# EasyEDA Pro project ProProject_NAFA AstrAlim_2024-01-08.epro, schematic AstrAlim NAFA

## Sheets
1 Base: Create Date: 2023-12-12; Page Name: Base; Project Name: NAFA AstrAlim; Schematic Name: AstrAlim NAFA; Update Date: 2024-01-05; Company: Velizy Astro Club; Drawed: Paul V.; Page Size: A4; Part Number: AstrAlim-v1.0; Reviewed: Denis G.; Version: V1.0
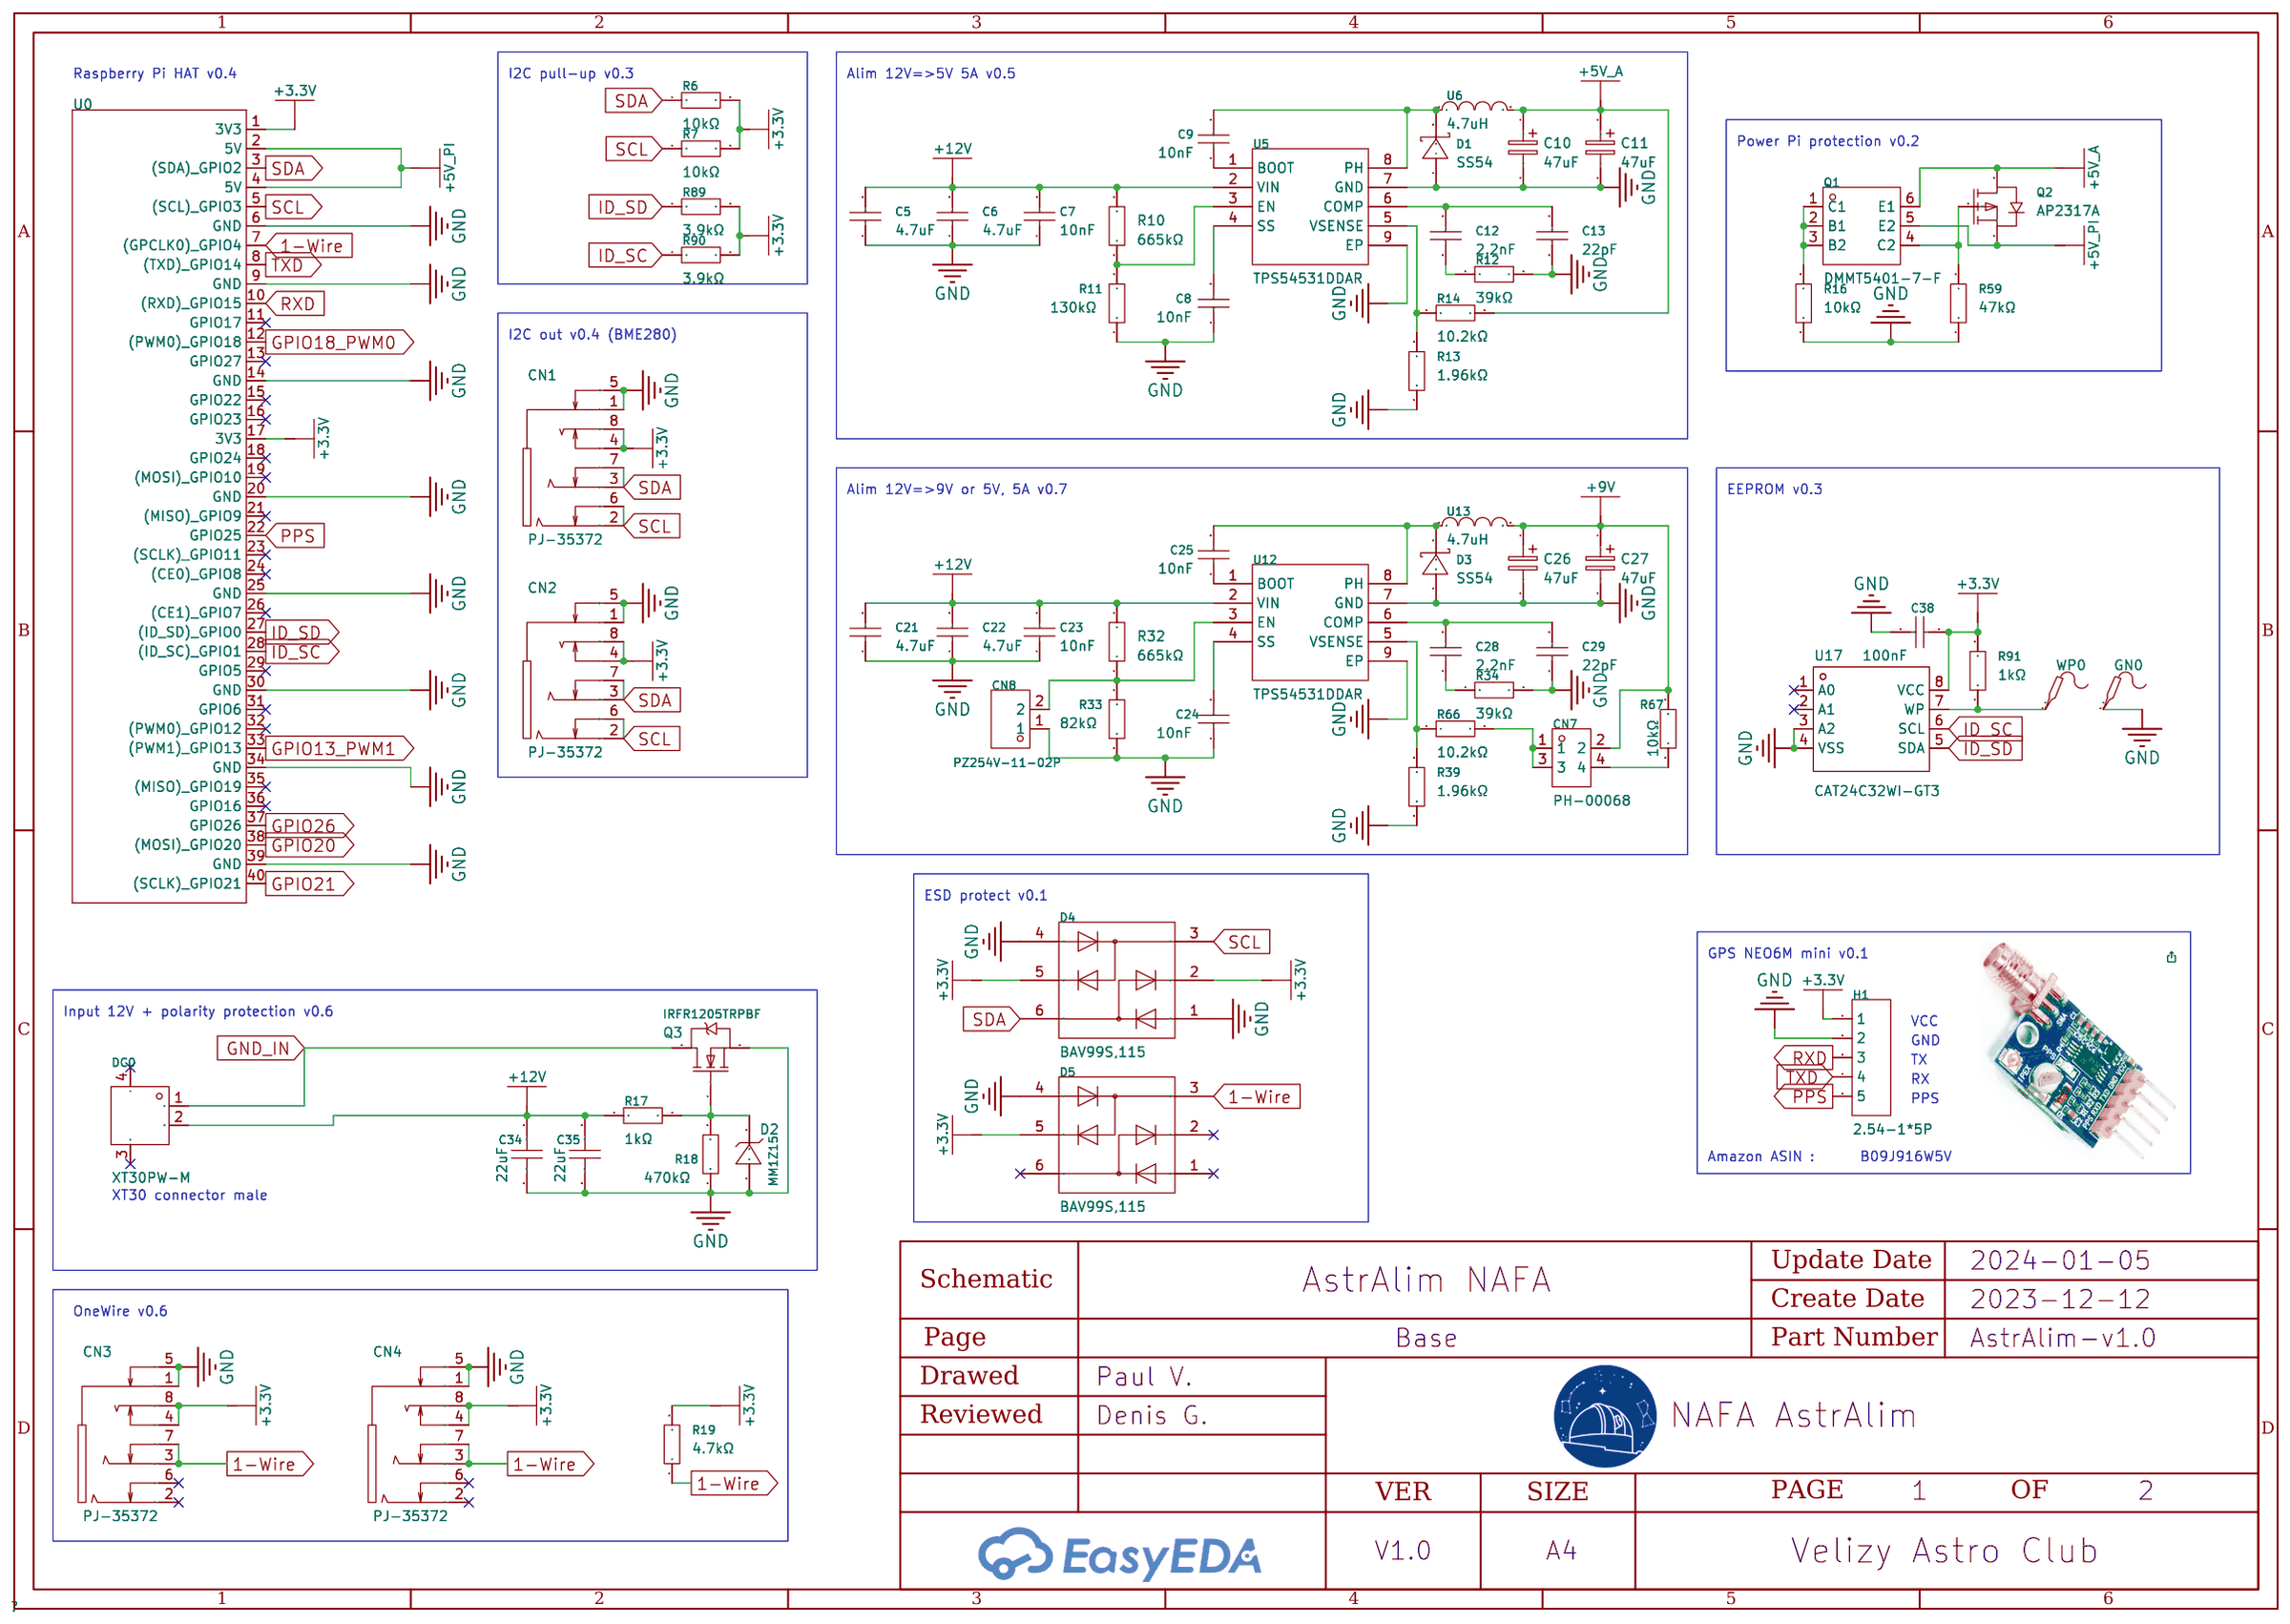
[diagram p0: Base]
2 Outputs: Create Date: 2023-12-28; Page Name: Outputs
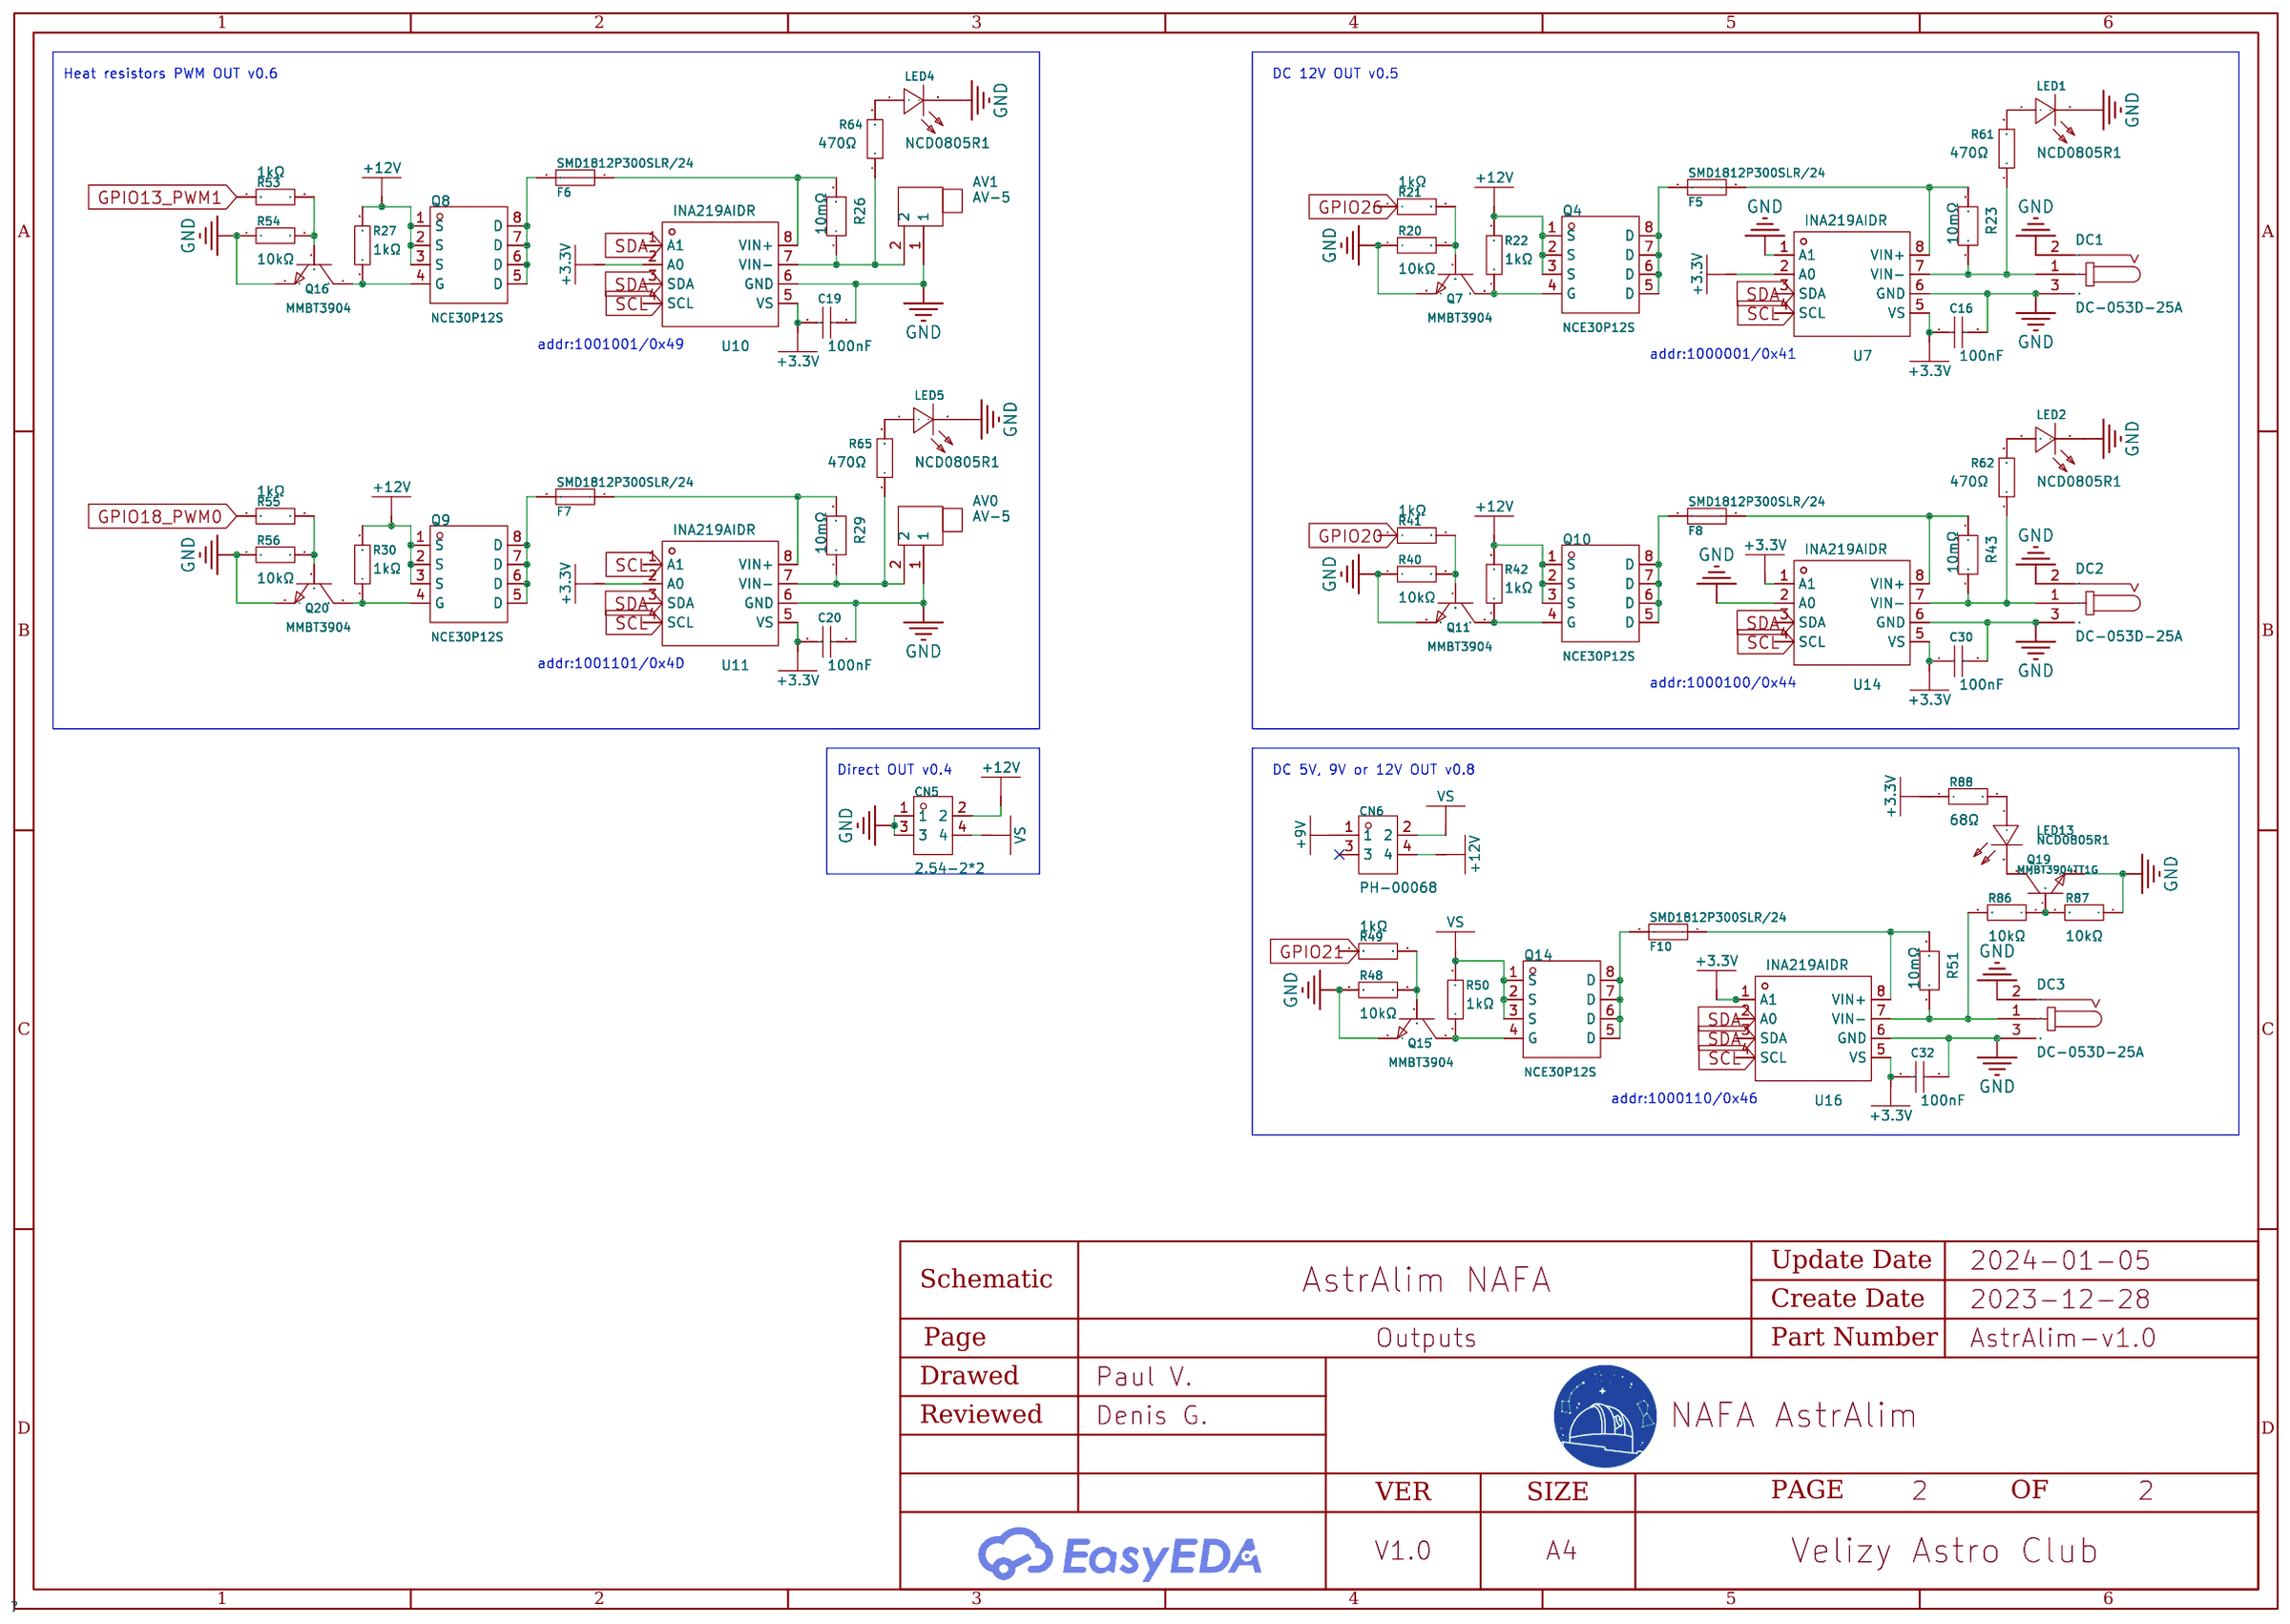
[diagram p1: Outputs]

## Parts
sheet Base
C5  4.7uF  [C0805]
C6  4.7uF  [C0805]
C7  10nF  [C0402]
C8  10nF  [C0402]
C9  10nF  [C0402]
C10  47uF  [CAP-SMD_L3.5-W2.8-R-RD]
C11  47uF  [CAP-SMD_L3.5-W2.8-R-RD]
C12  2.2nF  [C0603]
C13  22pF  [C0402]
C21  4.7uF  [C0805]
C22  4.7uF  [C0805]
C23  10nF  [C0402]
C24  10nF  [C0402]
C25  10nF  [C0402]
C26  47uF  [CAP-SMD_L3.5-W2.8-R-RD]
C27  47uF  [CAP-SMD_L3.5-W2.8-R-RD]
C28  2.2nF  [C0603]
C29  22pF  [C0402]
C34  22uF  [C0805]
C35  22uF  [C0805]
C38  100nF  [C0402]
CN1  PJ-35372  [AUDIO-TH_PJ-35372]
CN2  PJ-35372  [AUDIO-TH_PJ-35372]
CN3  PJ-35372  [AUDIO-TH_PJ-35372]
CN4  PJ-35372  [AUDIO-TH_PJ-35372]
CN7  PH-00068  [HDR-TH_4P-P2.54-V-M-R2-C2-S2.54]
CN8  PZ254V-11-02P  [HDR-TH_2P-P2.54-V-M]
D1  SS54  [SMA_L4.4-W2.8-LS5.4-R-RD]
D2  MM1Z15  [SOD-123_L2.7-W1.6-LS3.7-RD]
D3  SS54  [SMA_L4.4-W2.8-LS5.4-R-RD]
D4  BAV99S,115  [SOT-363_L2.0-W1.3-P0.65-LS2.1-TL]
D5  BAV99S,115  [SOT-363_L2.0-W1.3-P0.65-LS2.1-TL]
DC0  XT30PW-M  [CONN-TH_XT30PW-F-1]
GN0  -  [Test-Point-0.5mm]
H1  2.54-1*5P  [HDR-TH_5P-P2.54-V-F]
Q1  DMMT5401-7-F  [SOT-23-6_L2.9-W1.6-P0.95-LS2.8-BR]
Q2  AP2317A  [SOT-23-3_L2.9-W1.6-P1.90-LS2.8-BR]
Q3  IRFR1205TRPBF  [TO-252-3_L6.5-W5.8-P4.58-BL]
R6  10kΩ  [R0402]
R7  10kΩ  [R0402]
R10  665kΩ  [R0603]
R11  130kΩ  [R0603]
R12  39kΩ  [R0603]
R13  1.96kΩ  [R0402]
R14  10.2kΩ  [R0402]
R16  10kΩ  [R0402]
R17  1kΩ  [R0402]
R18  470kΩ  [R0603]
R19  4.7kΩ  [R0402]
R32  665kΩ  [R0603]
R33  82kΩ  [R0603]
R34  39kΩ  [R0603]
R39  1.96kΩ  [R0402]
R59  47kΩ  [R0402]
R66  10.2kΩ  [R0402]
R67  10kΩ  [R0402]
R89  3.9kΩ  [R0603]
R90  3.9kΩ  [R0603]
R91  1kΩ  [R0402]
U0  RASPI HAT FULL  [RASBERRYPI-3-HAT-EXT]  (no BOM)
U5  TPS54531DDAR  [SOIC-8_L5.0-W4.0-P1.27-LS6.0-BL-EP2.0]
U6  4.7uH  [IND-SMD_L7.2-W6.6_GPSR07X0]
U12  TPS54531DDAR  [SOIC-8_L5.0-W4.0-P1.27-LS6.0-BL-EP2.0]
U13  4.7uH  [IND-SMD_L7.2-W6.6_GPSR07X0]
U17  CAT24C32WI-GT3  [SOIC-8_L5.0-W4.0-P1.27-LS6.0-BL]
WP0  -  [Test-Point-0.5mm]
sheet Outputs
AV0  AV-5  [CONN-TH_AV-5]
AV1  AV-5  [CONN-TH_AV-5]
C16  100nF  [C0402]
C19  100nF  [C0402]
C20  100nF  [C0402]
C30  100nF  [C0402]
C32  100nF  [C0402]
CN5  2.54-2*2  [HDR-TH_4P-P2.54-V-F-R2-C2-S2.54]
CN6  PH-00068  [HDR-TH_4P-P2.54-V-M-R2-C2-S2.54]
DC1  DC-053D-25A  [DC-IN-TH_DC-053D-25A-1]
DC2  DC-053D-25A  [DC-IN-TH_DC-053D-25A-1]
DC3  DC-053D-25A  [DC-IN-TH_DC-053D-25A-1]
F5  SMD1812P300SLR/24  [F1812]
F6  SMD1812P300SLR/24  [F1812]
F7  SMD1812P300SLR/24  [F1812]
F8  SMD1812P300SLR/24  [F1812]
F10  SMD1812P300SLR/24  [F1812]
LED1  NCD0805R1  [LED0805-R-RD]
LED2  NCD0805R1  [LED0805-R-RD]
LED4  NCD0805R1  [LED0805-R-RD]
LED5  NCD0805R1  [LED0805-R-RD]
LED13  NCD0805R1  [LED0805-R-RD]
Q4  NCE30P12S  [SOIC-8_L4.9-W3.9-P1.27-LS6.0-BL]
Q7  MMBT3904  [SOT-23-3_L2.9-W1.3-P1.90-LS2.4-BR]
Q8  NCE30P12S  [SOIC-8_L4.9-W3.9-P1.27-LS6.0-BL]
Q9  NCE30P12S  [SOIC-8_L4.9-W3.9-P1.27-LS6.0-BL]
Q10  NCE30P12S  [SOIC-8_L4.9-W3.9-P1.27-LS6.0-BL]
Q11  MMBT3904  [SOT-23-3_L2.9-W1.3-P1.90-LS2.4-BR]
Q14  NCE30P12S  [SOIC-8_L4.9-W3.9-P1.27-LS6.0-BL]
Q15  MMBT3904  [SOT-23-3_L2.9-W1.3-P1.90-LS2.4-BR]
Q16  MMBT3904  [SOT-23-3_L2.9-W1.3-P1.90-LS2.4-BR]
Q19  MMBT3904TT1G  [SC-75-3_L1.6-W0.8-P1.00-LS1.6-BR]
Q20  MMBT3904  [SOT-23-3_L2.9-W1.3-P1.90-LS2.4-BR]
R20  10kΩ  [R0402]
R21  1kΩ  [R0402]
R22  1kΩ  [R0402]
R23  10mΩ  [R1206]
R26  10mΩ  [R1206]
R27  1kΩ  [R0402]
R29  10mΩ  [R1206]
R30  1kΩ  [R0402]
R40  10kΩ  [R0402]
R41  1kΩ  [R0402]
R42  1kΩ  [R0402]
R43  10mΩ  [R1206]
R48  10kΩ  [R0402]
R49  1kΩ  [R0402]
R50  1kΩ  [R0402]
R51  10mΩ  [R1206]
R53  1kΩ  [R0402]
R54  10kΩ  [R0402]
R55  1kΩ  [R0402]
R56  10kΩ  [R0402]
R61  470Ω  [R0402]
R62  470Ω  [R0402]
R64  470Ω  [R0402]
R65  470Ω  [R0402]
R86  10kΩ  [R0402]
R87  10kΩ  [R0402]
R88  68Ω  [R0603]
U7  INA219AIDR  [SOIC-8_L4.9-W3.9-P1.27-LS6.0-BL]
U10  INA219AIDR  [SOIC-8_L4.9-W3.9-P1.27-LS6.0-BL]
U11  INA219AIDR  [SOIC-8_L4.9-W3.9-P1.27-LS6.0-BL]
U14  INA219AIDR  [SOIC-8_L4.9-W3.9-P1.27-LS6.0-BL]
U16  INA219AIDR  [SOIC-8_L4.9-W3.9-P1.27-LS6.0-BL]

## Library data of the parts
C5 C6 C21 C22 = CL21A475KAQNNNE: Capacitance: Tolerance:±10% Tolerance:±10% Voltage Rated: Temperature Coefficient:; LCSC Part Name: 4.7uF ±10% 25V; Supplier Part: C1779; Manufacturer: SAMSUNG(三星); Supplier Footprint: 0805; Datasheet: https://atta.szlcsc.com/upload/public/pdf/source/20160218/1457707763339.pdf; Supplier: LCSC; Tolerance: ±10%
C7-C9 C23-C25 = CL05B103KB5NNNC: Capacitance: Tolerance:±10% Tolerance:±10% Voltage Rated: Temperature Coefficient:; LCSC Part Name: 10nF ±10% 50V; Supplier Part: C15195; Manufacturer: SAMSUNG(三星); Supplier Footprint: 0402; Datasheet: https://atta.szlcsc.com/upload/public/pdf/source/20160218/1457707763339.pdf; Supplier: LCSC; Tolerance: ±10%
C10 C11 C26 C27 = CA45-B-16V-47uF-K: Capacitance: Tolerance:±10% Tolerance:±10% Rated Voltage: Equivalent Series Resistance(ESR):3Ω@100kHz Operating Temperature:-55℃~+125℃ Operating Temperature:-55℃~+125℃; LCSC Part Name: 47uF ±10% 16V; Supplier Part: C136751; Manufacturer: CEC(振华新云); Supplier Footprint: CASE-B-3528; JLCPCB Part Class: Extended Part; Datasheet: https://atta.szlcsc.com/upload/public/pdf/source/20200817/C136751_89CB14FC7BB434027D9410E248BC6FA3.pdf; Supplier: LCSC; Tolerance: ±10%; Equivalent Series Resistance(ESR): 3Ω@100kHz; Operating Temperature: -55℃~+125℃
C12 C28 = 0603B222K500NT: Capacitance: Tolerance:±10% Tolerance:±10% Voltage Rated: Temperature Coefficient:; LCSC Part Name: 2.2nF ±10% 50V; Supplier Part: C1604; Manufacturer: FH(风华); Supplier Footprint: 0603; JLCPCB Part Class: Basic Part; Datasheet: https://atta.szlcsc.com/upload/public/pdf/source/20200305/C486355_26A10D38EF8C2A5C37091D0039909270.pdf; Supplier: LCSC; Tolerance: ±10%
C13 C29 = 0402CG220J500NT: Capacitance: Tolerance:±5% Tolerance:±5% Voltage Rated: Temperature Coefficient:; LCSC Part Name: 22pF ±5% 50V; Supplier Part: C1555; Manufacturer: FH(风华); Supplier Footprint: 0402; Datasheet: https://atta.szlcsc.com/upload/public/pdf/source/20200305/C486355_26A10D38EF8C2A5C37091D0039909270.pdf; Supplier: LCSC; Tolerance: ±5%
C34 C35 = CL21A226MAQNNNE_C45783: Capacitance: Tolerance:±20% Tolerance:±20% Voltage Rated: Temperature Coefficient:; LCSC Part Name: 22uF ±20% 25V; Supplier Part: C45783; Manufacturer: SAMSUNG(三星); Manufacturer Part: CL21A226MAQNNNE; Supplier Footprint: 0805; JLCPCB Part Class: Basic Part; Datasheet: https://atta.szlcsc.com/upload/public/pdf/source/20160218/1457707763339.pdf; Supplier: LCSC; Tolerance: ±20%
C16 C19 C20 C30 C32 C38 = CL05B104KO5NNNC: Capacitance: Tolerance:±10% Tolerance:±10% Voltage Rated: Temperature Coefficient:; LCSC Part Name: 100nF ±10% 16V; Supplier Part: C1525; Manufacturer: SAMSUNG(三星); Supplier Footprint: 0402; Datasheet: https://atta.szlcsc.com/upload/public/pdf/source/20160218/1457707763339.pdf; Supplier: LCSC; Tolerance: ±10%
CN1-CN4 = PJ-35372: Connector Type:3.5mm耳机座 Current Rating (Max):0.5A Voltage Rating (Max):30V Operating Temperature Range:-20℃~+70℃ Operating Temperature Range:-20℃~+70℃ Welding Temperature (Max):235℃; LCSC Part Name: 3.5mm耳机座 镀金4节; Supplier Part: C397354; Manufacturer: XKB Connectivity(中国星坤); Supplier Footprint: 插件; JLCPCB Part Class: Extended Part; Datasheet: https://atta.szlcsc.com/upload/public/pdf/source/20211011/70AECB394666925CFEDAEC6F68531937.pdf; Supplier: LCSC; Connector Type: 3.5mm耳机座; Current Rating (Max): 0.5A; Voltage Rating (Max): 30V; Operating Temperature Range: -20℃~+70℃; Welding Temperature (Max): 235℃
CN6 CN7 = PH-00068: Pin Structure:2x2P Pitch:2.54mm Number of Pins:4P Mounting Type:Straight Number of Rows:双排 Row Spacing:2.54mm Circluar Pins/Square Pins:Square Pins Current Rating (Max):3A Voltage Rating (Max):- Length of Mating Pin:6mm Insulation Height:2.5mm Length of E; LCSC Part Name: 间距:2.54mm 2x2P 直插 方针; Supplier Part: C2685136; Manufacturer: Liansheng(连盛); Supplier Footprint: 插件,P=2.54mm; JLCPCB Part Class: Extended Part; Datasheet: https://atta.szlcsc.com/upload/public/pdf/source/20210125/C2685136_23408E09F70DE804F536B1230959473E.pdf; Supplier: LCSC; Pin Structure: 2x2P; Pitch: 2.54mm; Number of Pins: 4P; Mounting Type: Straight; Number of Rows: 双排; Row Spacing: 2.54mm; Circluar Pins/Square Pins: Square Pins; Current Rating (Max): 3A; Length of Mating Pin: 6mm; Insulation Height: 2.5mm; Length of End Connection Pin: 3mm; Operating Temperature Range: -40℃~+105℃; Color: Black
CN8 = PZ254V-11-02P: Number of Rows:Plugin Number of Pins:2P Pitch:2.54mm Pin Structure:1x2P Row Spacing:- Mounting Type:Straight Circluar Pins/Square Pins:Square Pins Current Rating (Max):- Voltage Rating (Max):- Length of Mating Pin:6mm Insulation Height:2.5mm Length of End; LCSC Part Name: 2.54mm 1x2P 直插 方针; Supplier Part: C492401; Manufacturer: XFCN(兴飞); Supplier Footprint: 插件,P=2.54mm; JLCPCB Part Class: Extended Part; Datasheet: https://atta.szlcsc.com/upload/public/pdf/source/20200309/C492401_A812433581A9B211A7FFA413ADDFF0E5.pdf; Supplier: LCSC; Number of Rows: Plugin; Number of Pins: 2P; Pitch: 2.54mm; Pin Structure: 1x2P; Mounting Type: Straight; Circluar Pins/Square Pins: Square Pins; Length of Mating Pin: 6mm; Insulation Height: 2.5mm; Length of End Connection Pin: 3mm; Operating Temperature Range: -40℃~+105℃; Color: Black
D1 D3 = SS54_C22452: Forward Voltage (Vf@If):550mV@5A Reverse Voltage (Vr):40V Average Rectified Current (Io):5A Reverse Leakage Current (Ir):1mA@40V; LCSC Part Name: 电压:40V 电流:5A; Supplier Part: C22452; Manufacturer: MDD; Supplier Footprint: SMA(DO-214AC); JLCPCB Part Class: Basic Part; Datasheet: https://atta.szlcsc.com/upload/public/pdf/source/20230314/529CD85F9B31F69841D3A079BC07E377.pdf; Supplier: LCSC; Forward Voltage (Vf@If): 550mV@5A; Reverse Voltage (Vr): 40V; Average Rectified Current (Io): 5A; Reverse Leakage Current (Ir): 1mA@40V
D2 = MM1Z15_C86235: Diode Configuration:Single Zener Voltage (Nom):15V Zener Voltage (Range):13.8V~15.6V Zener Voltage (Range):13.8V~15.6V Tolerance:±5% Tolerance:±5% Power Dissipation:500mW Reverse Leakage Current (Ir):100nA@11V Zener Impedance (Zzt):40Ω; LCSC Part Name: 15V ±5% 500mW; Supplier Part: C86235; Manufacturer: ST(先科); Supplier Footprint: SOD-123; JLCPCB Part Class: Extended Part; Datasheet: https://atta.szlcsc.com/upload/public/pdf/source/20161104/1478240048404.pdf; Supplier: LCSC; Diode Configuration: Single; Zener Voltage (Nom): 15V; Zener Voltage (Range): 13.8V~15.6V; Tolerance: ±5%; Power Dissipation: 500mW; Reverse Leakage Current (Ir): 100nA@11V; Zener Impedance (Zzt): 40Ω
D4 D5 = BAV99S,115: Diode Configuration:2 Pair Series Connection Forward Voltage (Vf@If):1.25V@150mA Reverse Voltage (Vr): Average Rectified Current (Io): Power Dissipation: Reverse Leakage Current:500nA@80V Reverse Recovery Time (trr): Operating Temperature:- Operating Temp; LCSC Part Name: 电压:100V 电流:200mA; Supplier Part: C96225; Manufacturer: Nexperia(安世); Supplier Footprint: SOT-363; JLCPCB Part Class: Extended Part; Datasheet: https://atta.szlcsc.com/upload/public/pdf/source/20170225/1488010658895.pdf; Supplier: LCSC; Diode Configuration: 2 Pair Series Connection; Forward Voltage (Vf@If): 1.25V@150mA; Reverse Leakage Current: 500nA@80V
DC0 = XT30PW-F: Brand:艾迈斯 Model:XT30PW-F Power:- Output:- Input:- Size:- Interface:- Type:- Colour:- MaximumCurrent:- Type:航模插头 RatedVoltage:- Type1:- NumberOfUSBHoles:- InterfaceType:母头 MetalMaterial:- InsulationMaterial:- RatedCurrent:- RecommendedWireGauge:- FlameReta; LCSC Part Name: AMASS(艾迈斯)电源连接器 母头 XT30PW-F; Supplier Part: C2913282; Manufacturer: AMASS(艾迈斯); JLCPCB Part Class: Extended Part; Datasheet: https://atta.szlcsc.com/upload/public/pdf/source/20190916/C428722_DFF78979486FCB0B58C1FC563067EC88.pdf; Supplier: LCSC; Brand: 艾迈斯; Type: 航模插头; InterfaceType: 母头
GN0 WP0 = Test-Point: Test Point 测试点
H1 = 2.54-1*5P母: Number of Rows:Plugin Number of Holes:5P Pitch:2.54mm Holes Structure:1x5P Row Spacing:- Mounting Type:Straight Insulation Height:- Contact Material:- Contact Plating:-; LCSC Part Name: 间距:2.54mm 1x5P 直插; Supplier Part: C50950; Manufacturer: BOOMELE(博穆精密); Supplier Footprint: 插件,P=2.54mm; Datasheet: https://atta.szlcsc.com/upload/public/pdf/source/20210301/C2718488_F4427B881E42CAA8DDB0B1C12B3A522C.pdf; Supplier: LCSC; Number of Rows: Plugin; Number of Holes: 5P; Pitch: 2.54mm; Holes Structure: 1x5P; Mounting Type: Straight
Q1 = DMMT5401-7-F: Transistor Type: Collector Current (Ic): Collector-Emitter Breakdown Voltage (Vceo): Power Dissipation (Pd): DC Current Gain (hFE@Ic,Vce):60@10mA,5V DC Current Gain (hFE@Ic,Vce):60@10mA,5V Transition Frequency (fT):100MHz Collector Cut-Off Current (Icbo):; LCSC Part Name: 耐压:150V 电流:200mA 2个PNP; Supplier Part: C154733; Manufacturer: DIODES(美台); Supplier Footprint: SOT-26; JLCPCB Part Class: Extended Part; Datasheet: https://atta.szlcsc.com/upload/public/pdf/source/20171221/C154733_15138395184771195832.pdf; Supplier: LCSC; DC Current Gain (hFE@Ic,Vce): 60@10mA,5V; Transition Frequency (fT): 100MHz; Collector Cut-Off Current (Icbo): 50nA; Collector-Emitter Saturation Voltage (VCE(sat)@Ic,Ib): 500mV@50mA,5mA; Operating Temperature: -55℃~+150℃@(Tj)
Q2 = AP2317A: Type: Drain Source Voltage (Vdss): Continuous Drain Current (Id): Power Dissipation (Pd): Drain Source On Resistance (RDS(on)@Vgs,Id):17mΩ@4.5V,6A Gate Threshold Voltage (Vgs(th)@Id):550mV@250uA Total Gate Charge (Qg@Vgs):19.5nC@4.5V Input Capacitance (Ci; LCSC Part Name: P沟道 耐压:20V 电流:6A; Supplier Part: C2828580; Manufacturer: ALLPOWER(铨力); Supplier Footprint: SOT-23; JLCPCB Part Class: Extended Part; Datasheet: https://atta.szlcsc.com/upload/public/pdf/source/20210507/C2828580_530881B2B373441A6AA528134FC390E1.pdf; Supplier: LCSC; Drain Source On Resistance (RDS(on)@Vgs,Id): 17mΩ@4.5V,6A; Gate Threshold Voltage (Vgs(th)@Id): 550mV@250uA; Total Gate Charge (Qg@Vgs): 19.5nC@4.5V; Input Capacitance (Ciss@Vds): 1.73nF@6V; Reverse Transfer Capacitance (Crss@Vds): 210pF@6V; Operating Temperature: -55℃~+150℃@(Tj)
Q3 = IRFR1205TRPBF: Type: Drain Source Voltage (Vdss): Continuous Drain Current (Id): Power Dissipation (Pd): Drain Source On Resistance (RDS(on)@Vgs,Id):27mΩ@10V,26A Gate Threshold Voltage (Vgs(th)@Id):4V@250uA Total Gate Charge (Qg@Vgs):65nC@10V Input Capacitance (Ciss@Vds; LCSC Part Name: N沟道 55V 44A; Supplier Part: C81467; Manufacturer: Infineon(英飞凌); Supplier Footprint: TO-252-2(DPAK); JLCPCB Part Class: Extended Part; Datasheet: https://atta.szlcsc.com/upload/public/pdf/source/20161123/1479873080518.pdf; Supplier: LCSC; Drain Source On Resistance (RDS(on)@Vgs,Id): 27mΩ@10V,26A; Gate Threshold Voltage (Vgs(th)@Id): 4V@250uA; Total Gate Charge (Qg@Vgs): 65nC@10V; Input Capacitance (Ciss@Vds): 1300pF@25V; Operating Temperature: -55℃~+175℃@(Tj)
R6 R7 R16 R20 R40 R48 R54 R56 R67 R86 R87 = 0402WGF1002TCE: Resistance:10000Ω Tolerance:±1% Tolerance:±1% Power(Watts): Overload Voltage (Max): Temperature Coefficient:±100ppm/℃ Temperature Coefficient:±100ppm/℃ Type:Thick Film Resistors Operating Temperature Range:-55℃~+155℃ Operating Temperature Range:-55℃~+155℃; LCSC Part Name: 10kΩ ±1% 62.5mW 厚膜电阻; Supplier Part: C25744; Manufacturer: UNI-ROYAL(厚声); Supplier Footprint: 0402; Datasheet: https://atta.szlcsc.com/upload/public/pdf/source/20200306/C422600_1E6D84923E4A46A82E41ADD87F860B5C.pdf; Supplier: LCSC; Tolerance: ±1%; Temperature Coefficient: ±100ppm/℃; Type: Thick Film Resistors; Operating Temperature Range: -55℃~+155℃
R10 R32 = AC0603FR-07665KL: Type:Thick Film Resistors Resistance: Tolerance:±1% Tolerance:±1% Power(Watts): Temperature Coefficient:±100ppm/℃ Temperature Coefficient:±100ppm/℃ Overload Voltage (Max): Operating Temperature Range:-55℃~+155℃ Operating Temperature Range:-55℃~+155℃; LCSC Part Name: 665kΩ ±1% 100mW; Supplier Part: C228009; Manufacturer: YAGEO(国巨); Supplier Footprint: 0603; JLCPCB Part Class: Extended Part; Datasheet: https://atta.szlcsc.com/upload/public/pdf/source/20181114/C228009_87E2C19250925041AC9BA1374DD90882.pdf; Supplier: LCSC; Type: Thick Film Resistors; Tolerance: ±1%; Temperature Coefficient: ±100ppm/℃; Operating Temperature Range: -55℃~+155℃
R11 = 0603WAF1303T5E: Resistance:130000Ω Tolerance:±1% Tolerance:±1% Power(Watts): Overload Voltage (Max): Temperature Coefficient:±100ppm/℃ Temperature Coefficient:±100ppm/℃ Type:Thick Film Resistors Operating Temperature Range:-55℃~+155℃ Operating Temperature Range:-55℃~+155; LCSC Part Name: 130kΩ ±1% 100mW 厚膜电阻; Supplier Part: C22795; Manufacturer: UNI-ROYAL(厚声); Supplier Footprint: 0603; Datasheet: https://atta.szlcsc.com/upload/public/pdf/source/20200306/C422600_1E6D84923E4A46A82E41ADD87F860B5C.pdf; Supplier: LCSC; Tolerance: ±1%; Temperature Coefficient: ±100ppm/℃; Type: Thick Film Resistors; Operating Temperature Range: -55℃~+155℃
R12 R34 = 0603WAF3902T5E: Resistance:39000Ω Tolerance:±1% Tolerance:±1% Power(Watts): Overload Voltage (Max): Temperature Coefficient:±100ppm/℃ Temperature Coefficient:±100ppm/℃ Type:Thick Film Resistors Operating Temperature Range:-55℃~+155℃ Operating Temperature Range:-55℃~+155℃; LCSC Part Name: 39kΩ ±1% 100mW 厚膜电阻; Supplier Part: C23153; Manufacturer: UNI-ROYAL(厚声); Supplier Footprint: 0603; JLCPCB Part Class: Basic Part; Datasheet: https://atta.szlcsc.com/upload/public/pdf/source/20200306/C422600_1E6D84923E4A46A82E41ADD87F860B5C.pdf; Supplier: LCSC; Tolerance: ±1%; Temperature Coefficient: ±100ppm/℃; Type: Thick Film Resistors; Operating Temperature Range: -55℃~+155℃
R13 R39 = 0402WGF1961TCE: Resistance:1960Ω Tolerance:±1% Tolerance:±1% Power(Watts): Overload Voltage (Max): Temperature Coefficient:±100ppm/℃ Temperature Coefficient:±100ppm/℃ Type:Thick Film Resistors Operating Temperature Range:-55℃~+155℃ Operating Temperature Range:-55℃~+155℃; LCSC Part Name: 1.96kΩ ±1% 62.5mW 厚膜电阻; Supplier Part: C70427; Manufacturer: UNI-ROYAL(厚声); Supplier Footprint: 0402; JLCPCB Part Class: Extended Part; Datasheet: https://atta.szlcsc.com/upload/public/pdf/source/20200306/C422600_1E6D84923E4A46A82E41ADD87F860B5C.pdf; Supplier: LCSC; Tolerance: ±1%; Temperature Coefficient: ±100ppm/℃; Type: Thick Film Resistors; Operating Temperature Range: -55℃~+155℃
R14 R66 = 0402WGF1022TCE: Resistance:10200Ω Tolerance:±1% Tolerance:±1% Power(Watts): Overload Voltage (Max): Temperature Coefficient:±100ppm/℃ Temperature Coefficient:±100ppm/℃ Type:Thick Film Resistors Operating Temperature Range:-55℃~+155℃ Operating Temperature Range:-55℃~+155℃; LCSC Part Name: 10.2kΩ ±1% 62.5mW 厚膜电阻; Supplier Part: C11660; Manufacturer: UNI-ROYAL(厚声); Supplier Footprint: 0402; JLCPCB Part Class: Extended Part; Datasheet: https://atta.szlcsc.com/upload/public/pdf/source/20200306/C422600_1E6D84923E4A46A82E41ADD87F860B5C.pdf; Supplier: LCSC; Tolerance: ±1%; Temperature Coefficient: ±100ppm/℃; Type: Thick Film Resistors; Operating Temperature Range: -55℃~+155℃
R17 R21 R22 R27 R30 R41 R42 R49 R50 R53 R55 R91 = 0402WGF1001TCE: Resistance:1000Ω Tolerance:±1% Tolerance:±1% Power(Watts): Overload Voltage (Max): Temperature Coefficient:±100ppm/℃ Temperature Coefficient:±100ppm/℃ Type:Thick Film Resistors Operating Temperature Range:-55℃~+155℃ Operating Temperature Range:-55℃~+155℃; LCSC Part Name: 1kΩ ±1% 62.5mW 厚膜电阻; Supplier Part: C11702; Manufacturer: UNI-ROYAL(厚声); Supplier Footprint: 0402; JLCPCB Part Class: Basic Part; Datasheet: https://atta.szlcsc.com/upload/public/pdf/source/20200306/C422600_1E6D84923E4A46A82E41ADD87F860B5C.pdf; Supplier: LCSC; Tolerance: ±1%; Temperature Coefficient: ±100ppm/℃; Type: Thick Film Resistors; Operating Temperature Range: -55℃~+155℃
R18 = 0603WAF4703T5E: Resistance:470000Ω Tolerance:±1% Tolerance:±1% Power(Watts): Overload Voltage (Max): Temperature Coefficient:±100ppm/℃ Temperature Coefficient:±100ppm/℃ Type:Thick Film Resistors Operating Temperature Range:-55℃~+155℃ Operating Temperature Range:-55℃~+155; LCSC Part Name: 470kΩ ±1% 100mW 厚膜电阻; Supplier Part: C23178; Manufacturer: UNI-ROYAL(厚声); Supplier Footprint: 0603; JLCPCB Part Class: Basic Part; Datasheet: https://atta.szlcsc.com/upload/public/pdf/source/20200306/C422600_1E6D84923E4A46A82E41ADD87F860B5C.pdf; Supplier: LCSC; Tolerance: ±1%; Temperature Coefficient: ±100ppm/℃; Type: Thick Film Resistors; Operating Temperature Range: -55℃~+155℃
R19 = 0402WGF4701TCE: Resistance:4700Ω Tolerance:±1% Tolerance:±1% Power(Watts): Overload Voltage (Max): Temperature Coefficient:±100ppm/℃ Temperature Coefficient:±100ppm/℃ Type:Thick Film Resistors Operating Temperature Range:-55℃~+155℃ Operating Temperature Range:-55℃~+155℃; LCSC Part Name: 4.7kΩ ±1% 62.5mW 厚膜电阻; Supplier Part: C25900; Manufacturer: UNI-ROYAL(厚声); Supplier Footprint: 0402; Datasheet: https://atta.szlcsc.com/upload/public/pdf/source/20200306/C422600_1E6D84923E4A46A82E41ADD87F860B5C.pdf; Supplier: LCSC; Tolerance: ±1%; Temperature Coefficient: ±100ppm/℃; Type: Thick Film Resistors; Operating Temperature Range: -55℃~+155℃
R33 = 0603WAF8202T5E: Resistance:82000Ω Tolerance:±1% Tolerance:±1% Power(Watts): Overload Voltage (Max): Temperature Coefficient:±100ppm/℃ Temperature Coefficient:±100ppm/℃ Type:Thick Film Resistors Operating Temperature Range:-55℃~+155℃ Operating Temperature Range:-55℃~+155℃; LCSC Part Name: 82kΩ ±1% 100mW 厚膜电阻; Supplier Part: C23254; Manufacturer: UNI-ROYAL(厚声); Supplier Footprint: 0603; JLCPCB Part Class: Basic Part; Datasheet: https://atta.szlcsc.com/upload/public/pdf/source/20200306/C422600_1E6D84923E4A46A82E41ADD87F860B5C.pdf; Supplier: LCSC; Tolerance: ±1%; Temperature Coefficient: ±100ppm/℃; Type: Thick Film Resistors; Operating Temperature Range: -55℃~+155℃
R59 = 0402WGF4702TCE: Resistance:47000Ω Tolerance:±1% Tolerance:±1% Power(Watts): Overload Voltage (Max): Temperature Coefficient:±100ppm/℃ Temperature Coefficient:±100ppm/℃ Type:Thick Film Resistors Operating Temperature Range:-55℃~+155℃ Operating Temperature Range:-55℃~+155℃; LCSC Part Name: 47kΩ ±1% 62.5mW 厚膜电阻; Supplier Part: C25792; Manufacturer: UNI-ROYAL(厚声); Supplier Footprint: 0402; JLCPCB Part Class: Basic Part; Datasheet: https://atta.szlcsc.com/upload/public/pdf/source/20200306/C422600_1E6D84923E4A46A82E41ADD87F860B5C.pdf; Supplier: LCSC; Tolerance: ±1%; Temperature Coefficient: ±100ppm/℃; Type: Thick Film Resistors; Operating Temperature Range: -55℃~+155℃
R89 R90 = 0603WAF3901T5E: Resistance:3900Ω Tolerance:±1% Tolerance:±1% Power(Watts): Overload Voltage (Max): Temperature Coefficient:±100ppm/℃ Temperature Coefficient:±100ppm/℃ Type:Thick Film Resistors Operating Temperature Range:-55℃~+155℃ Operating Temperature Range:-55℃~+155℃; LCSC Part Name: 3.9kΩ ±1% 100mW 厚膜电阻; Supplier Part: C23018; Manufacturer: UNI-ROYAL(厚声); Supplier Footprint: 0603; JLCPCB Part Class: Basic Part; Datasheet: https://atta.szlcsc.com/upload/public/pdf/source/20200306/C422600_1E6D84923E4A46A82E41ADD87F860B5C.pdf; Supplier: LCSC; Tolerance: ±1%; Temperature Coefficient: ±100ppm/℃; Type: Thick Film Resistors; Operating Temperature Range: -55℃~+155℃
U0 = RASPI HAT FULL - NO OUTLINE: Manufacturer Part: RaspberryPi 3
U5 U12 = TPS54531DDAR: Function:Step-down type Synchronous Rectification:NO Output Type:Adjustable Number of Outputs:1 Topology:Step-down Input Voltage:3.5V~28V Input Voltage:3.5V~28V Output Voltage:0.8V~26.04V Output Voltage:0.8V~26.04V Output Current (Max):5A Switching Freque; Supplier Part: C50605; Manufacturer: TI(德州仪器); Supplier Footprint: SOP-8-EP; Datasheet: https://www.ti.com/cn/lit/gpn/tps54531; Supplier: LCSC; Function: Step-down type; Synchronous Rectification: NO; Output Type: Adjustable; Number of Outputs: 1; Topology: Step-down; Input Voltage: 3.5V~28V; Output Voltage: 0.8V~26.04V; Output Current (Max): 5A; Switching Frequency: 570kHz; Operating Temperature: -40℃~+85℃@(TA)
U6 U13 = CYA0630-4.7UH: Inductance: Tolerance:±20% Tolerance:±20% Rated Current: DC Resistance (DCR):34.5mΩ; LCSC Part Name: 4.7uH ±20%; Supplier Part: C5189748; Manufacturer: SHOU HAN(首韩); Supplier Footprint: SMD,6.6x7.2mm; Datasheet: https://atta.szlcsc.com/upload/public/pdf/source/20221010/79ACBE86DD414F23A670753564343C1B.pdf; Supplier: LCSC; Tolerance: ±20%; DC Resistance (DCR): 34.5mΩ
U17 = CAT24C32WI-GT3: LCSC Part Name: EEPROM 串行 32-Kb I2C; Supplier Part: C81193; Manufacturer: onsemi(安森美); Supplier Footprint: SOIC-8; JLCPCB Part Class: Extended Part; Datasheet: https://atta.szlcsc.com/upload/public/pdf/source/20160823/1471947541961.PDF; Supplier: LCSC
AV0 AV1 = AV-5: Connector Type:3.5mm耳机座 Current Rating (Max):- Voltage Rating (Max):- Operating Temperature Range:- Operating Temperature Range:-; LCSC Part Name: 3.5mm耳机座; Supplier Part: C18080; Manufacturer: BOOMELE(博穆精密); Supplier Footprint: 插件; Datasheet: https://atta.szlcsc.com/upload/public/pdf/source/20180413/C18080_9898B25CAC1CB4F289527A482D4B303F.pdf; Supplier: LCSC; Connector Type: 3.5mm耳机座
CN5 = 2.54-2*2: Number of Rows:双排 Number of Holes:4P Pitch:2.54mm Holes Structure:2x2P Row Spacing:2.54mm Mounting Type:Straight Circular Hole / Square Hole:Square Holes Current Rating (Max):2.5A Voltage Rating (Max):- Holes Direction:Top Insulation Height:8.5mm Operatin; LCSC Part Name: 间距:2.54mm 2x2P 直插 镀金环保阻燃UL认证; Supplier Part: C2977590; Manufacturer: ZHOURI(洲日); Supplier Footprint: 插件,P=2.54mm; Datasheet: https://atta.szlcsc.com/upload/public/pdf/source/20220328/0DEB63D734370D90CA736158671615A0.pdf; Supplier: LCSC; Number of Rows: 双排; Number of Holes: 4P; Pitch: 2.54mm; Holes Structure: 2x2P; Row Spacing: 2.54mm; Mounting Type: Straight; Circular Hole / Square Hole: Square Holes; Current Rating (Max): 2.5A; Holes Direction: Top; Insulation Height: 8.5mm; Operating Temperature Range: -40℃~+105℃
DC1-DC3 = DC-053D-25A: Connector Type:DC Power Receptacle Mounting Style:Shrouded Inside Contact Diameter:2.5mm Outside Contact Diameter:6.5mm Current Rating (Max):10A Voltage Rating (Max):16V Operating Temperature Range:-20℃~+70℃ Operating Temperature Range:-20℃~+70℃; LCSC Part Name: DC电源插座 内径:2.5mm 外径:6.5mm 大电流; Supplier Part: C2686352; Manufacturer: 韩国韩荣; Supplier Footprint: 插件; JLCPCB Part Class: Extended Part; Datasheet: https://atta.szlcsc.com/upload/public/pdf/source/20211013/02DB261FD23242C4DED947007A9F6266.pdf; Supplier: LCSC; Connector Type: DC Power Receptacle; Mounting Style: Shrouded; Inside Contact Diameter: 2.5mm; Outside Contact Diameter: 6.5mm; Current Rating (Max): 10A; Voltage Rating (Max): 16V; Operating Temperature Range: -20℃~+70℃
F5-F8 F10 = SMD1812P300SLR/24_C2892380: Operating Voltage (Max):24V Current Rating (Max):50A Hold Current:3A Trip Current:6A Power Dissipation:2W Resistance - Initial (Ri) (Min):0.001Ω Resistance - Post Trip (R1) (Max):0.03Ω Maximum Time to Trip:2s Operating Temperature:-40℃~+85℃ Operating Temp; LCSC Part Name: 24V 3A 1812自恢复; Supplier Part: C2892380; Manufacturer: PTTC(聚鼎); Supplier Footprint: 1812; Datasheet: https://atta.szlcsc.com/upload/public/pdf/source/20210907/343DD7605ED2928A15A4368A27FC0089.pdf; Supplier: LCSC; Operating Voltage (Max): 24V; Current Rating (Max): 50A; Hold Current: 3A; Trip Current: 6A; Power Dissipation: 2W; Resistance - Initial (Ri) (Min): 0.001Ω; Resistance - Post Trip (R1) (Max): 0.03Ω; Maximum Time to Trip: 2s; Operating Temperature: -40℃~+85℃
LED1 LED2 LED4 LED5 LED13 = NCD0805R1_C84256: Emitted Color:Red Diode Configuration:- Lamp Holder Type:- Forward Voltage (VF):1.6V~2.6V Forward Voltage (VF):1.6V~2.6V Forward Current:20mA Power Dissipation:65mW Lens Color:无色透明 Dominant Wavelength:615nm~630nm Dominant Wavelength:615nm~630nm Peak Wavel; LCSC Part Name: 红灯 0805红灯   正贴; Supplier Part: C84256; Manufacturer: 国星光电; Supplier Footprint: 0805; JLCPCB Part Class: Basic Part; Datasheet: https://atta.szlcsc.com/upload/public/pdf/source/20200820/C84256_F0A75A43B3EAD75808600A0514C76B99.pdf; Supplier: LCSC; Emitted Color: Red; Forward Voltage (VF): 1.6V~2.6V; Forward Current: 20mA; Power Dissipation: 65mW; Lens Color: 无色透明; Dominant Wavelength: 615nm~630nm; Luminous Intensity: 67mcd~195mcd; Viewing Angle: 130°; Operating Temperature: -30℃~+85℃
Q4 Q8-Q10 Q14 = NCE30P12S: Type: Drain Source Voltage (Vdss): Continuous Drain Current (Id): Power Dissipation (Pd): Drain Source On Resistance (RDS(on)@Vgs,Id):15mΩ@10V,10A Gate Threshold Voltage (Vgs(th)@Id):3V@250uA; LCSC Part Name: P沟道 30V 12A; Supplier Part: C167515; Manufacturer: NCE(无锡新洁能); Supplier Footprint: SOIC-8-150mil; Datasheet: https://atta.szlcsc.com/upload/public/pdf/source/20180224/C167515_15194366503051363671.pdf; Supplier: LCSC; Drain Source On Resistance (RDS(on)@Vgs,Id): 15mΩ@10V,10A; Gate Threshold Voltage (Vgs(th)@Id): 3V@250uA
Q7 Q11 Q15 Q16 Q20 = MMBT3904_C20526: Transistor Type: Collector Current (Ic): Collector-Emitter Breakdown Voltage (Vceo): Power Dissipation (Pd): DC Current Gain (hFE@Ic,Vce):100@10mA,1V DC Current Gain (hFE@Ic,Vce):100@10mA,1V Transition Frequency (fT):300MHz Collector Cut-Off Current (Icbo; LCSC Part Name: NPN 电流:200mA 耐压:40V hfe=100~300; Supplier Part: C20526; Manufacturer: CJ(江苏长电/长晶); Supplier Footprint: SOT-23; JLCPCB Part Class: Basic Part; Datasheet: https://atta.szlcsc.com/upload/public/pdf/source/20220704/70F575FB75061E03F919270A6BB8BA7F.pdf; Supplier: LCSC; DC Current Gain (hFE@Ic,Vce): 100@10mA,1V; Transition Frequency (fT): 300MHz; Collector Cut-Off Current (Icbo): 100nA; Collector-Emitter Saturation Voltage (VCE(sat)@Ic,Ib): 300mV@50mA,5mA
Q19 = MMBT3904TT1G: Transistor Type: Collector Current (Ic): Collector-Emitter Breakdown Voltage (Vceo): Power Dissipation (Pd): DC Current Gain (hFE@Ic,Vce):100@10mA,1V DC Current Gain (hFE@Ic,Vce):100@10mA,1V Transition Frequency (fT):300MHz Collector-Emitter Saturation Vo; LCSC Part Name: 耐压:40V 电流:200mA NPN; Supplier Part: C242260; Manufacturer: onsemi(安森美); Supplier Footprint: SOT-416; JLCPCB Part Class: Extended Part; Datasheet: https://atta.szlcsc.com/upload/public/pdf/source/20221020/8C70A8ED36C1D333CEA0E7EE045B4434.pdf; Supplier: LCSC; DC Current Gain (hFE@Ic,Vce): 100@10mA,1V; Transition Frequency (fT): 300MHz; Collector-Emitter Saturation Voltage (VCE(sat)@Ic,Ib): 300mV@5mA,50mA; Operating Temperature: -55℃~+150℃@(Tj)
R23 R26 R29 R43 R51 = MFJ06HR010FT: Resistance:10mΩ Tolerance:±1% Tolerance:±1% Power(Watts): Temperature Coefficient:±50ppm/℃ Temperature Coefficient:±50ppm/℃ Overload Voltage (Max):- Operating Temperature Range:-55℃~+170℃ Operating Temperature Range:-55℃~+170℃; LCSC Part Name: 10mΩ ±1% 1W; Supplier Part: C2961483; Manufacturer: FH(风华); Supplier Footprint: 1206; Datasheet: https://atta.szlcsc.com/upload/public/pdf/source/20220214/48262AE2350561E4ADC39CA7942CE443.pdf; Supplier: LCSC; Tolerance: ±1%; Temperature Coefficient: ±50ppm/℃; Operating Temperature Range: -55℃~+170℃
R61 R62 R64 R65 = 0402WGF4700TCE: Resistance: Tolerance:±1% Tolerance:±1% Power(Watts): Overload Voltage (Max): Temperature Coefficient:±100ppm/℃ Temperature Coefficient:±100ppm/℃ Type:Thick Film Resistors Operating Temperature Range:-55℃~+155℃ Operating Temperature Range:-55℃~+155℃; LCSC Part Name: 470Ω ±1% 62.5mW 厚膜电阻; Supplier Part: C25117; Manufacturer: UNI-ROYAL(厚声); Supplier Footprint: 0402; JLCPCB Part Class: Basic Part; Datasheet: https://atta.szlcsc.com/upload/public/pdf/source/20200306/C422600_1E6D84923E4A46A82E41ADD87F860B5C.pdf; Supplier: LCSC; Tolerance: ±1%; Temperature Coefficient: ±100ppm/℃; Type: Thick Film Resistors; Operating Temperature Range: -55℃~+155℃
R88 = 0603WAF680JT5E: Resistance:68000mΩ Tolerance:±1% Tolerance:±1% Power(Watts): Overload Voltage (Max): Temperature Coefficient:±100ppm/℃ Temperature Coefficient:±100ppm/℃ Type:Thick Film Resistors Operating Temperature Range:-55℃~+155℃ Operating Temperature Range:-55℃~+155; LCSC Part Name: 68Ω ±1% 100mW 厚膜电阻; Supplier Part: C27592; Manufacturer: UNI-ROYAL(厚声); Supplier Footprint: 0603; JLCPCB Part Class: Extended Part; Datasheet: https://atta.szlcsc.com/upload/public/pdf/source/20200306/C422600_1E6D84923E4A46A82E41ADD87F860B5C.pdf; Supplier: LCSC; Tolerance: ±1%; Temperature Coefficient: ±100ppm/℃; Type: Thick Film Resistors; Operating Temperature Range: -55℃~+155℃
U7 U10 U11 U14 U16 = INA219AIDR: Supplier Part: C138706; Manufacturer: TI(德州仪器); Supplier Footprint: SOIC-8; Datasheet: https://atta.szlcsc.com/upload/public/pdf/source/20171102/C138706_15096093032041078451.pdf; Supplier: LCSC

## Nets
+3.3V: C16.1 C19.1 C20.1 C30.1 C32.1 C38.2 CN1.4 CN1.8 CN2.4 CN2.8 CN3.4 CN3.8 CN4.4 CN4.8 D4.2(C) D4.5(C) D5.5(C) H1.1 R6.2 R7.2 R19.2 R88.1 R89.2 R90.2 R91.2 U0.1(3V3) U0.17(3V3) U7.2(A0) U7.5(VS) U10.2(A0) U10.5(VS) U11.2(A0) U11.5(VS) U14.1(A1) U14.5(VS) U16.1(A1) U16.5(VS) U17.8(VCC)
+5V_A: C10.1 C11.1 Q1.6(E1) Q2.3(D) R14.2 U6.2
+5V_PI: Q1.5(E2) Q2.2(S) U0.2(5V) U0.4(5V)
+9V: C26.1 C27.1 CN6.1 CN7.2 R67.2 U13.2
+12V: C5.2 C6.2 C7.2 C21.2 C22.2 C23.2 C34.2 C35.2 CN5.2 CN6.4 DC0.2 Q4.1(S) Q4.2(S) Q4.3(S) Q8.1(S) Q8.2(S) Q8.3(S) Q9.1(S) Q9.2(S) Q9.3(S) Q10.1(S) Q10.2(S) Q10.3(S) R10.2 R17.1 R22.2 R27.2 R30.2 R32.2 R42.2 U5.2(VIN) U12.2(VIN)
GND: AV0.1 AV1.1 C5.1 C6.1 C7.1 C8.1 C10.2 C11.2 C13.1 C16.2 C19.2 C20.2 C21.1 C22.1 C23.1 C24.1 C26.2 C27.2 C29.1 C30.2 C32.2 C34.1 C35.1 C38.1 CN1.1 CN1.5 CN2.1 CN2.5 CN3.1 CN3.5 CN4.1 CN4.5 CN5.1 CN5.3 CN8.1 D1.1(A) D2.2(A) D3.1(A) D4.1(A) D4.4(A) D5.4(A) DC1.2 DC1.3 DC2.2 DC2.3 DC3.2 DC3.3 GN0.1 H1.2 LED1.2(-) LED2.2(-) LED4.2(-) LED5.2(-) Q3.3(S) Q7.2(E) Q11.2(E) Q15.2(E) Q16.2(E) Q19.2(E) Q20.2(E) R11.1 R12.2 R13.1 R16.1 R18.1 R20.1 R33.1 R34.2 R39.1 R40.1 R48.1 R54.1 R56.1 R59.1 R87.1 U0.6(GND) U0.9(GND) U0.14(GND) U0.20(GND) U0.25(GND) U0.30(GND) U0.34(GND) U0.39(GND) U5.7(GND) U5.9(EP) U7.1(A1) U7.6(GND) U10.6(GND) U11.6(GND) U12.7(GND) U12.9(EP) U14.2(A0) U14.6(GND) U16.6(GND) U17.3(A2) U17.4(VSS)
GND_IN: DC0.1 Q3.2(D)
1-Wire: CN3.3 CN3.7 CN4.3 CN4.7 D5.3(AC) R19.1 U0.7((GPCLK0) GPIO4)
GPIO13_PWM1: R53.1 U0.33((PWM1) GPIO13)
GPIO18_PWM0: R55.1 U0.12((PWM0) GPIO18)
GPIO20: R41.1 U0.38((MOSI) GPIO20)
GPIO21: R49.1 U0.40((SCLK) GPIO21)
GPIO26: R21.1 U0.37(GPIO26)
ID_SC: R90.1 U0.28((ID_SC) GPIO1) U17.6(SCL)
ID_SD: R89.1 U0.27((ID_SD) GPIO0) U17.5(SDA)
PPS: H1.5 U0.22(GPIO25)
RXD: H1.3 U0.10((RXD) GPIO15)
SCL: CN1.2 CN1.6 CN2.2 CN2.6 D4.3(AC) R7.1 U0.5((SCL) GPIO3) U7.4(SCL) U10.4(SCL) U11.1(A1) U11.4(SCL) U14.4(SCL) U16.4(SCL)
SDA: CN1.3 CN1.7 CN2.3 CN2.7 D4.6(AC) R6.1 U0.3((SDA) GPIO2) U7.3(SDA) U10.1(A1) U10.3(SDA) U11.3(SDA) U14.3(SDA) U16.2(A0) U16.3(SDA)
TXD: H1.4 U0.8((TXD) GPIO14)
VS: CN5.4 CN6.2 Q14.1(S) Q14.2(S) Q14.3(S) R50.2
$1N4635: R10.1 R11.2 U5.3(EN)
$1N4659: C8.2 U5.4(SS)
$1N4694: C9.1 U5.1(BOOT)
$1N4920: C9.2 D1.2(K) U5.8(PH) U6.1
$1N5140: C12.1 R12.1
$1N5148: C12.2 C13.2 U5.6(COMP)
$1N5310: R13.2 R14.1 U5.5(VSENSE)
$1N7006: Q1.4(C2) Q2.1(G) R59.2
$1N7063: Q1.1(C1) Q1.2(B1) Q1.3(B2) R16.2
$1N14594: C24.2 U12.4(SS)
$1N14595: C25.1 U12.1(BOOT)
$1N14596: C25.2 D3.2(K) U12.8(PH) U13.1
$1N14599: C28.1 R34.1
$1N14601: C28.2 C29.2 U12.6(COMP)
$1N14603: R39.2 R66.1 U12.5(VSENSE)
$1N50988: CN7.4 R67.1
$1N55064: CN7.1 CN7.3 R66.2
$1N55959: D2.1(C) Q3.1(G) R17.2 R18.2
$1N59627: CN8.2 R32.1 R33.2 U12.3(EN)
$1N62787: R91.1 U17.7(WP) WP0.1
$2N529: Q7.1(B) R20.2 R21.2
$2N530: Q4.4(G) Q7.3(C) R22.1
$2N536: F5.1 R23.2 U7.8(VIN+)
$2N538: F5.2 Q4.5(D) Q4.6(D) Q4.7(D) Q4.8(D)
$2N1597: Q8.4(G) Q16.3(C) R27.1
$2N1603: F6.1 R26.2 U10.8(VIN+)
$2N1605: F6.2 Q8.5(D) Q8.6(D) Q8.7(D) Q8.8(D)
$2N1610: Q9.4(G) Q20.3(C) R30.1
$2N1616: F7.1 R29.2 U11.8(VIN+)
$2N1618: F7.2 Q9.5(D) Q9.6(D) Q9.7(D) Q9.8(D)
$2N3421: Q11.1(B) R40.2 R41.2
$2N3422: Q10.4(G) Q11.3(C) R42.1
$2N3428: F8.1 R43.2 U14.8(VIN+)
$2N3430: F8.2 Q10.5(D) Q10.6(D) Q10.7(D) Q10.8(D)
$2N4457: Q15.1(B) R48.2 R49.2
$2N4458: Q14.4(G) Q15.3(C) R50.1
$2N4464: F10.1 R51.2 U16.8(VIN+)
$2N4466: F10.2 Q14.5(D) Q14.6(D) Q14.7(D) Q14.8(D)
$2N24815: Q16.1(B) R53.2 R54.2
$2N25317: Q20.1(B) R55.2 R56.2
$2N39826: LED4.1(+) R64.2
$2N39921: LED5.1(+) R65.2
$2N39926: AV1.2 R26.1 R64.1 U10.7(VIN-)
$2N39937: AV0.2 R29.1 R65.1 U11.7(VIN-)
$2N40038: LED1.1(+) R61.2
$2N40133: LED2.1(+) R62.2
$2N40233: DC3.1 R51.1 R86.2 U16.7(VIN-)
$2N40244: DC2.1 R43.1 R62.1 U14.7(VIN-)
$2N40255: DC1.1 R23.1 R61.1 U7.7(VIN-)
$2N49861: Q19.1(B) R86.1 R87.2
$2N50059: LED13.2(-) Q19.3(C)
$2N57491: LED13.1(+) R88.2

Not connected (* = marked no-connect by the designer): CN3 2* 6*; CN4 2* 6*; CN6 3*; D5 1(A)* 2(C)* 6(AC)*; DC0 3* 4*; U0 11(GPIO17)* 13(GPIO27)* 15(GPIO22)* 16(GPIO23)* 18(GPIO24)* 19((MOSI) GPIO10)* 21((MISO) GPIO9)* 23((SCLK) GPIO11)* 24((CE0) GPIO8)* 26((CE1) GPIO7)* 29(GPIO5)* 31(GPIO6)* 32((PWM0) GPIO12)* 35((MISO) GPIO19)* 36(GPIO16)*; U17 1(A0)* 2(A1)*

## Notes on the sheets
sheet 1
- Raspberry Pi HAT v0.4
- I2C pull-up v0.3
- Alim 12V=>5V 5A v0.5
- Power Pi protection v0.2
- I2C out v0.4 (BME280)
- Alim 12V=>9V or 5V, 5A v0.7
- EEPROM v0.3
- ESD protect v0.1
- GPS NEO6M mini v0.1
- Input 12V + polarity protection v0.6
- VCC
- GND
- TX
- RX
- PPS
- Amazon ASIN :	B09J916W5V
- XT30 connector male
- OneWire v0.6
sheet 2
- Heat resistors PWM OUT v0.6
- DC 12V OUT v0.5
- addr:1001001/0x49
- addr:1000001/0x41
- addr:1001101/0x4D
- addr:1000100/0x44
- Direct OUT v0.4
- DC 5V, 9V or 12V OUT v0.8
- addr:1000110/0x46
